# Altium schematic sheet VHF_AMP.SchDoc: VHF RF AMP
size A4; DocumentNumber: 17; Revision: 2.0; SheetNumber: 17; SheetTotal: 18
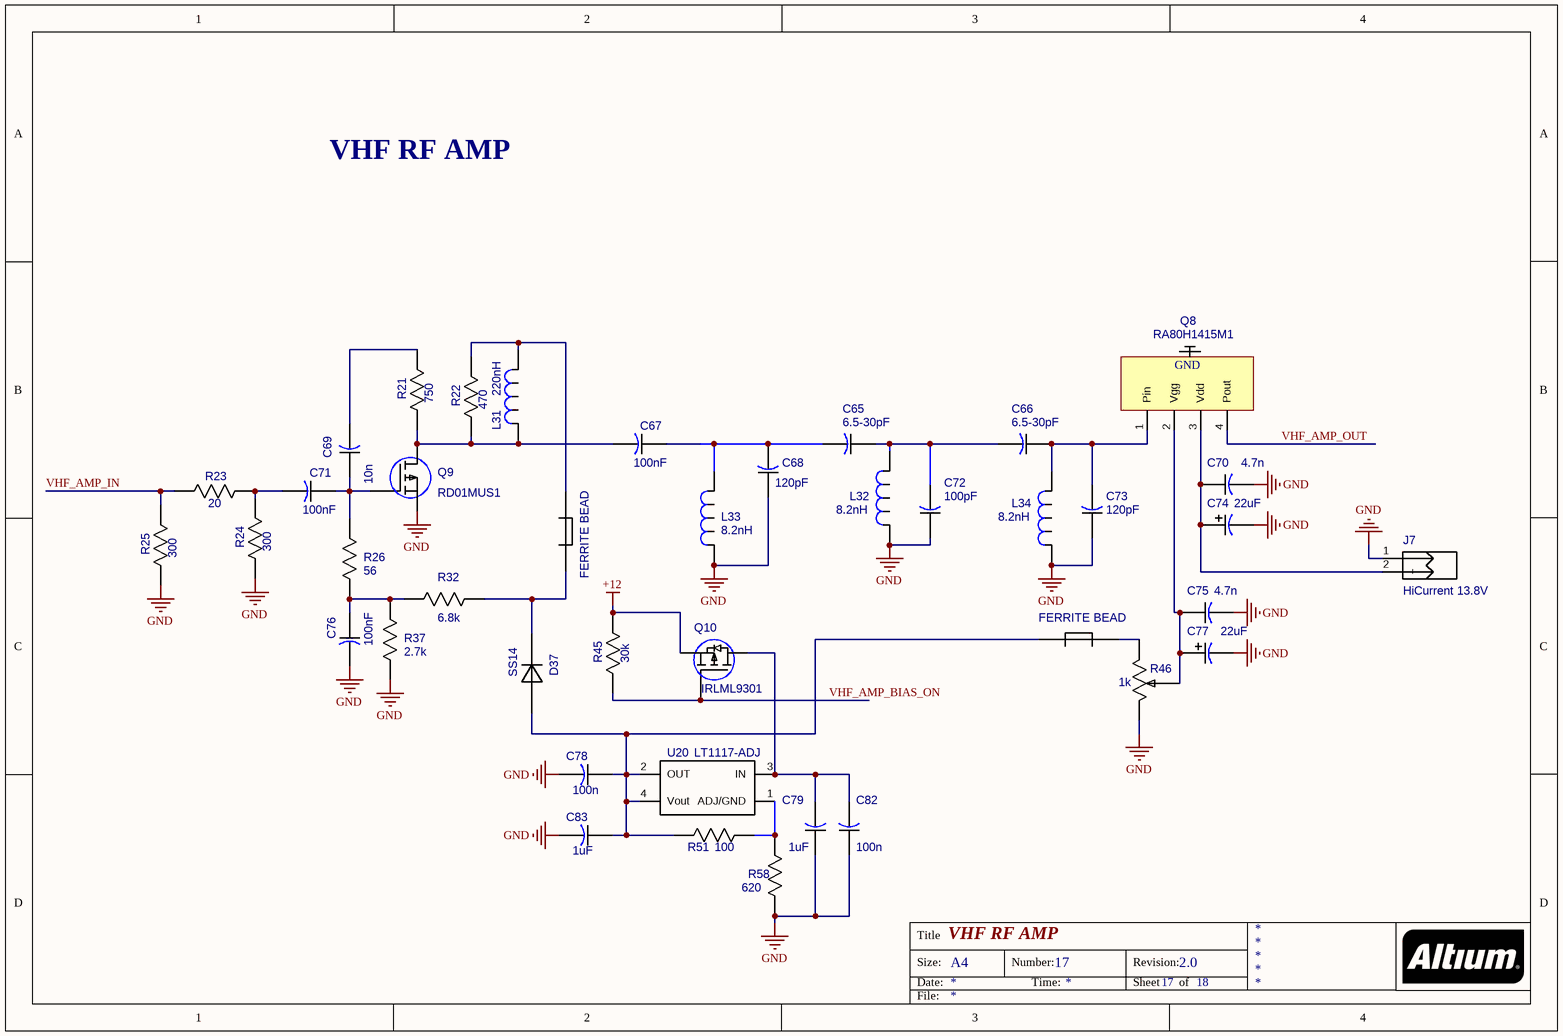
[diagram p0: VHF_AMP.SchDoc]

## Parts
C65  6.5-30pF  [5025[2010]]
C66  6.5-30pF  [5025[2010]]
C67  100nF  [CAP_0805]
C68  120pF  [CAP_0805]
C69  10n  [CAP_1206]
C70  4.7n  [CAP_0805]
C71  100nF  [CAP_0805]
C72  100pF  [CAP_0805]
C73  120pF  [CAP_0805]
C74  22uF  [CAPAE_6.6x6.6h5.4]
C75  4.7n  [CAP_0805]
C76  100nF  [CAP_0805]
C77  22uF  [CAPAE_6.6x6.6h5.4]
C78  100n  [CAP_0805]
C79  1uF  [CAP_0805]
C82  100n  [CAP_0805]
C83  1uF  [CAP_0805]
D37  SS14  [SS14]
F1  FERRITE BEAD  [RES]
F2  FERRITE BEAD  [RES]
J7  HiCurrent 13.8V  [1986717-2]
L31  value 220nH  [IND_1206]  (hidden comment: 10uH)
L32  8.2nH  [IND_0805]
L33  8.2nH  [IND_0805]
L34  8.2nH  [IND_0805]
Q8  RA80H1415M1  [RA80H1415M1]
Q9  RD01MUS1  [SOT89]
Q10  IRLML9301  [SOT23]
R21  750  [RES_1206]
R22  470  [RES_1206]
R23  20  [RES_1206]
R24  300  [RES_1206]
R25  300  [RES_1206]
R26  56  [RES_0805]
R32  6.8k  [RES_0805]
R37  2.7k  [RES_0805]
R45  30k  [RES_0805]
R46  value 1k  [306J]  (hidden comment: ADJ-1k)
R51  100  [RES_0805]
R58  620  [RES_0805]
U20  value LT1117-ADJ  [LT1117IST-ADJ]  (hidden comment: LT1117IST-ADJ)

## Nets
+12: Q10.2(S) R45.2
GND: C68.1 C70.2 C72.1 C73.1 C74.2(MINUS) C75.2 C76.2 C77.2(MINUS) C78.2 C79.1 C82.1 C83.2 J7.1(-) L32.1 L33.1 L34.1 Q9.2(S) R24.1 R25.1 R37.1 R46.1(CCW) R58.2
VHF_AMP_BIAS_ON: Q10.1(G) R45.1
VHF_AMP_IN: R23.1 R25.2
VHF_AMP_OUT: Q8.4(Pout)
NetC65_1: C65.1 C66.2 C72.2 L32.2
NetC65_2: C65.2 C67.1 C68.2 L33.2
NetC66_1: C66.1 C73.2 L34.2 Q8.1(Pin)
NetC67_2: C67.2 L31.2 Q9.3(D) R21.1 R22.1
NetC69_1: C69.1 C71.1 Q9.1(G) R26.2
NetC69_2: C69.2 R21.2
NetC70_1: C70.1 C74.1(PLUS) J7.2(+) Q8.3(Vdd)
NetC71_2: C71.2 R23.2 R24.2
NetC75_1: C75.1 C77.1(PLUS) Q8.2(Vgg) R46.2(W)
NetC76_1: C76.1 R26.1 R32.2 R37.2
NetC78_1: C78.1 C83.1 D37.2(A) F2.1 R51.1 U20.2(OUT) U20.4(Vout)
NetC79_2: C79.2 C82.2 Q10.3(D) U20.3(IN)
NetD37_1: D37.1(K) F1.2 R32.1
NetF1_1: F1.1 L31.1 R22.2
NetF2_2: F2.2 R46.3(CW)
NetR51_2: R51.2 R58.1 U20.1(ADJ/GND)

## Notes on the sheet
- VHF RF AMP
- Title
- Size:
- Date:
- A4
- Number:
- Time:
- Revision:
- Sheet
- of
- File:
- (in symbol RA80H1415M1) GND

## Library data of the parts
C65 C66 = CAP_0805: TZC3P300A110; Value: 6.5-30pF
C67 C68 C70-C73 C75 C76 C78 C79 C82 C83 = CAP_0805
  C67 C71 C76: Value: 100nF
  C68 C73: Value: 120pF
  C72: Value: 100pF
  C78 C82: Value: 100n
  C79 C83: Value: 1uF
C69 = CAP_1206
C74 C77 = CAPAE_6.6x6.6h5.4
F1 F2 = IND_FERRITE_BEAD: Value: *
J7 = 1986717-2: JX2
L31 = IND_1206
L32-L34 = IND_0805: Value: 8.2nH
Q10 = MOSFET_ENH_PD: MOSFET; Value: IRLML9301
R21-R25 = RES_1206
R26 R32 R37 R45 R51 R58 = RES_0805
  R45: Value: 30k
R46 = 306J
D37 = SS14: Value: SS14
Q8 = RA80H1415M1: Value: *
Q9 = RD01MUS1: Value: *